# Altium schematic sheet betaV2.3.SchDoc
size A3; Organization: Altium Limited; Address1: L3, 12a Rodborough Rd; Address2: Frenchs Forest; Address3: NSW; Address4: Australia 2086
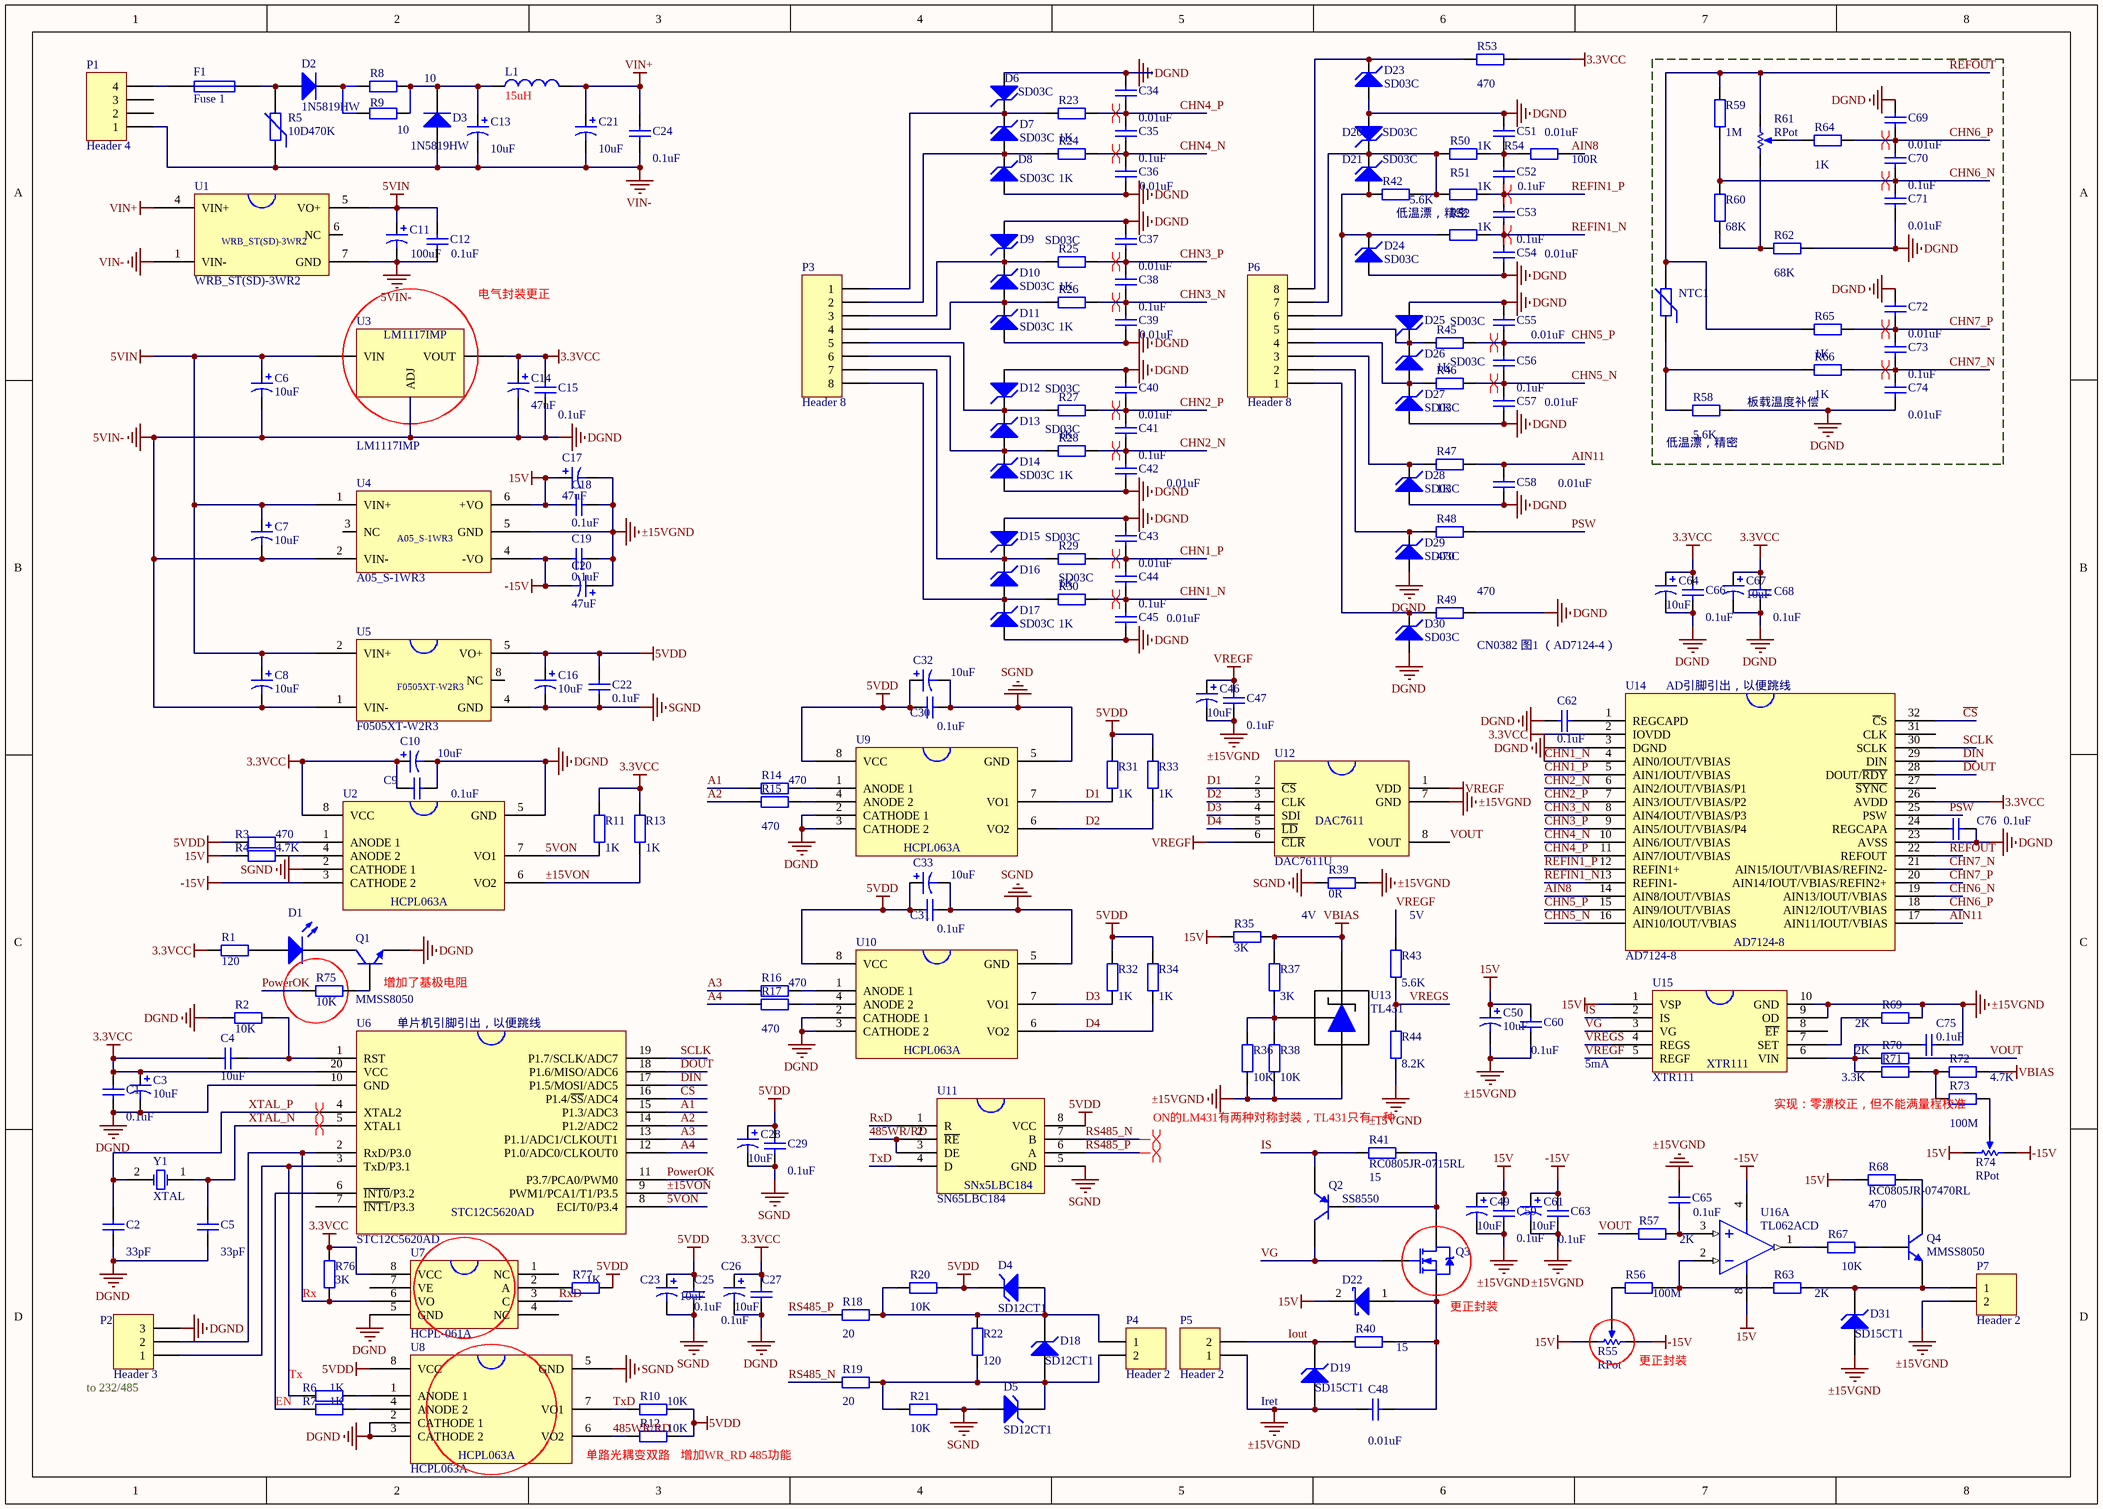
[diagram p0: betaV2.3.SchDoc]

## Parts
C1  value 0.1uF  [0805c]  (hidden comment: CC0805MRX7R9BB104)
C2  value 33pF  [0805c]  (hidden comment: CC0805MRX7R9BB330)
C3  value 10uF  [CB]  (hidden comment: T494B106M006AHAUTO)
C4  value 10uF  [0805c]  (hidden comment: CC0805MRX7R9BB106)
C5  value 33pF  [0805c]  (hidden comment: CC0805MRX7R9BB330)
C6  value 10uF  [CB]  (hidden comment: T494B106M006AHAUTO)
C7  value 10uF  [CB]  (hidden comment: T494B106M006AHAUTO)
C8  value 10uF  [CB]  (hidden comment: T494B106M006AHAUTO)
C9  value 0.1uF  [0805c]  (hidden comment: CC0805MRX7R9BB104)
C10  value 10uF  [CB]  (hidden comment: T494B106M006AHAUTO)
C11  value 100uF  [CB]  (hidden comment: T494B107M006AHAUTO)
C12  value 0.1uF  [0805c]  (hidden comment: CC0805MRX7R9BB104)
C13  value 10uF  [Φ6.3×11.5]  (hidden comment: ECR1HQG100M-063007)
C14  value 47uF  [CB]  (hidden comment: T494B476M010AHAUTO)
C15  value 0.1uF  [0805c]  (hidden comment: CC0805MRX7R9BB104)
C16  value 10uF  [CB]  (hidden comment: T494B106M006AHAUTO)
C17  value 47uF  [CB]  (hidden comment: T494B476K025ATAUTO)
C18  value 0.1uF  [0805c]  (hidden comment: CC0805MRX7R9BB104)
C19  value 0.1uF  [0805c]  (hidden comment: CC0805MRX7R9BB104)
C20  value 47uF  [CB]  (hidden comment: T494B476K025ATAUTO)
C21  value 10uF  [Φ6.3×11.5]  (hidden comment: ECR1HQG100M-063007)
C22  value 0.1uF  [0805c]  (hidden comment: CC0805MRX7R9BB104)
C23  value 10uF  [CB]  (hidden comment: T494B106M006AHAUTO)
C24  value 0.1uF  [0805c]  (hidden comment: CC0805MRX7R9BB104)
C25  value 0.1uF  [0805c]  (hidden comment: CC0805MRX7R9BB104)
C26  value 10uF  [CB]  (hidden comment: T494B106M006AHAUTO)
C27  value 0.1uF  [0805c]  (hidden comment: CC0805MRX7R9BB104)
C28  value 10uF  [CB]  (hidden comment: T494B106M006AHAUTO)
C29  value 0.1uF  [0805c]  (hidden comment: CC0805MRX7R9BB104)
C30  value 0.1uF  [0805c]  (hidden comment: CC0805MRX7R9BB104)
C31  value 0.1uF  [0805c]  (hidden comment: CC0805MRX7R9BB104)
C32  value 10uF  [CB]  (hidden comment: T494B106M006AHAUTO)
C33  value 10uF  [CB]  (hidden comment: T494B106M006AHAUTO)
C34  value 0.01uF  [0805c]  (hidden comment: CC0805MRX7R9BB103)
C35  value 0.1uF  [0805c]  (hidden comment: CC0805MRX7R9BB104)
C36  value 0.01uF  [0805c]  (hidden comment: CC0805MRX7R9BB103)
C37  value 0.01uF  [0805c]  (hidden comment: CC0805MRX7R9BB103)
C38  value 0.1uF  [0805c]  (hidden comment: CC0805MRX7R9BB104)
C39  value 0.01uF  [0805c]  (hidden comment: CC0805MRX7R9BB103)
C40  value 0.01uF  [0805c]  (hidden comment: CC0805MRX7R9BB103)
C41  value 0.1uF  [0805c]  (hidden comment: CC0805MRX7R9BB104)
C42  value 0.01uF  [0805c]  (hidden comment: CC0805MRX7R9BB103)
C43  value 0.01uF  [0805c]  (hidden comment: CC0805MRX7R9BB103)
C44  value 0.1uF  [0805c]  (hidden comment: CC0805MRX7R9BB104)
C45  value 0.01uF  [0805c]  (hidden comment: CC0805MRX7R9BB103)
C46  value 10uF  [CB]  (hidden comment: T494B106M006AHAUTO)
C47  value 0.1uF  [0805c]  (hidden comment: CC0805MRX7R9BB104)
C48  value 0.01uF  [0805c]  (hidden comment: CC0805MRX7R9BB103)
C49  value 10uF  [CB]  (hidden comment: T494B106M025AHAUTO)
C50  value 10uF  [CB]  (hidden comment: T494B106M025AHAUTO)
C51  value 0.01uF  [0805c]  (hidden comment: CC0805MRX7R9BB103)
C52  value 0.1uF  [0805c]  (hidden comment: CC0805MRX7R9BB104)
C53  value 0.1uF  [0805c]  (hidden comment: CC0805MRX7R9BB104)
C54  value 0.01uF  [0805c]  (hidden comment: CC0805MRX7R9BB103)
C55  value 0.01uF  [0805c]  (hidden comment: CC0805MRX7R9BB103)
C56  value 0.1uF  [0805c]  (hidden comment: CC0805MRX7R9BB104)
C57  value 0.01uF  [0805c]  (hidden comment: CC0805MRX7R9BB103)
C58  value 0.01uF  [0805c]  (hidden comment: CC0805MRX7R9BB103)
C59  value 0.1uF  [0805c]  (hidden comment: CC0805MRX7R9BB104)
C60  value 0.1uF  [0805c]  (hidden comment: CC0805MRX7R9BB104)
C61  value 10uF  [CB]  (hidden comment: T494B106M025AHAUTO)
C62  value 0.1uF  [0805c]  (hidden comment: CC0805MRX7R9BB104)
C63  value 0.1uF  [0805c]  (hidden comment: CC0805MRX7R9BB104)
C64  value 10uF  [CB]  (hidden comment: T494B106M006AHAUTO)
C65  value 0.1uF  [0805c]  (hidden comment: CC0805MRX7R9BB104)
C66  value 0.1uF  [0805c]  (hidden comment: CC0805MRX7R9BB104)
C67  value 10uF  [CB]  (hidden comment: T494B106M006AHAUTO)
C68  value 0.1uF  [0805c]  (hidden comment: CC0805MRX7R9BB104)
C69  value 0.01uF  [0805c]  (hidden comment: CC0805MRX7R9BB103)
C70  value 0.1uF  [0805c]  (hidden comment: CC0805MRX7R9BB104)
C71  value 0.01uF  [0805c]  (hidden comment: CC0805MRX7R9BB103)
C72  value 0.01uF  [0805c]  (hidden comment: CC0805MRX7R9BB103)
C73  value 0.1uF  [0805c]  (hidden comment: CC0805MRX7R9BB104)
C74  value 0.01uF  [0805c]  (hidden comment: CC0805MRX7R9BB103)
C75  value 0.1uF  [0805c]  (hidden comment: CC0805MRX7R9BB104)
C76  value 0.1uF  [0805c]  (hidden comment: CC0805MRX7R9BB104)
D1  150080GS75000  [LEDΦ3.0]  (value not drawn)
D2  1N5819HW  [sod123]
D3  1N5819HW  [sod123]
D4  SD12CT1  [sod323]
D5  SD12CT1  [sod323]
D6  SD03C  [sod323]
D7  SD03C  [sod323]
D8  SD03C  [sod323]
D9  SD03C  [sod323]
D10  SD03C  [sod323]
D11  SD03C  [sod323]
D12  SD03C  [sod323]
D13  SD03C  [sod323]
D14  SD03C  [sod323]
D15  SD03C  [sod323]
D16  SD03C  [sod323]
D17  SD03C  [sod323]
D18  SD12CT1  [sod323]
D19  SD15CT1  [sod323]
D20  SD03C  [sod323]
D21  SD03C  [sod323]
D22  RB160MM-50TF  [sod123]  (value not drawn)
D23  SD03C  [sod323]
D24  SD03C  [sod323]
D25  SD03C  [sod323]
D26  SD03C  [sod323]
D27  SD03C  [sod323]
D28  SD03C  [sod323]
D29  SD03C  [sod323]
D30  SD03C  [sod323]
D31  SD15CT1  [sod323]
F1  Fuse 1  [0805r]
L1  value 15uH  [vls4012]  (hidden comment: VLS4012HBX-150M)
NTC1  NTCS0805E3103JHT  [0805r]  (value not drawn)
P1  Header 4  [HDR1X4]
P2  Header 3  [HDR1X3]
P3  Header 8  [HDR1X8]
P4  Header 2  [HDR1X2]
P5  Header 2  [HDR1X2]
P6  Header 8  [HDR1X8]
P7  Header 2  [HDR1X2]
Q1  MMSS8050  [SOT-23-BJT]
Q2  SS8550  [SOT-23-BJT]
Q3  SI2309  [SOT-23-MOS]  (value not drawn)
Q4  MMSS8050  [SOT-23-BJT]
R1  value 120  [0805R]  (hidden comment: RC0805JR-07120RL)
R2  value 10K  [0805R]  (hidden comment: RC0805JR-0710KL)
R3  value 470  [0805R]  (hidden comment: RC0805JR-07470RL)
R4  value 4.7K  [0805R]  (hidden comment: RC0805JR-074700RL)
R5  10D470K  [mov]
R6  value 1K  [0805R]  (hidden comment: RC0805JR-071KL)
R7  value 1K  [0805R]  (hidden comment: RC0805JR-071KL)
R8  value 10  [0805R]  (hidden comment: PNP-200KJBJ26-10R)
R9  value 10  [0805R]  (hidden comment: PNP-200KJBJ26-10R)
R10  value 10K  [0805R]  (hidden comment: RC0805JR-0710KRL)
R11  value 1K  [0805R]  (hidden comment: RC0805JR-071KL)
R12  value 10K  [0805R]  (hidden comment: RC0805JR-0710KRL)
R13  value 1K  [0805R]  (hidden comment: RC0805JR-071KL)
R14  value 470  [0805R]  (hidden comment: RC0805JR-07470RL)
R15  value 470  [0805R]  (hidden comment: RC0805JR-07470RL)
R16  value 470  [0805R]  (hidden comment: RC0805JR-07470RL)
R17  value 470  [0805R]  (hidden comment: RC0805JR-07470RL)
R18  value 20  [0805R]  (hidden comment: RC0805JR-0720RL)
R19  value 20  [0805R]  (hidden comment: RC0805JR-0720RL)
R20  value 10K  [0805R]  (hidden comment: RC0805JR-0710KL)
R21  value 10K  [0805R]  (hidden comment: RC0805JR-0710KL)
R22  value 120  [0805R]  (hidden comment: RC0805JR-07120RL)
R23  value 1K  [0805R]  (hidden comment: RC0805JR-071KL)
R24  value 1K  [0805R]  (hidden comment: RC0805JR-071KL)
R25  value 1K  [0805R]  (hidden comment: RC0805JR-071KL)
R26  value 1K  [0805R]  (hidden comment: RC0805JR-071KL)
R27  value 1K  [0805R]  (hidden comment: RC0805JR-071KL)
R28  value 1K  [0805R]  (hidden comment: RC0805JR-071KL)
R29  value 1K  [0805R]  (hidden comment: RC0805JR-071KL)
R30  value 1K  [0805R]  (hidden comment: RC0805JR-071KL)
R31  value 1K  [0805R]  (hidden comment: RC0805JR-071KL)
R32  value 1K  [0805R]  (hidden comment: RC0805JR-071KL)
R33  value 1K  [0805R]  (hidden comment: RC0805JR-071KL)
R34  value 1K  [0805R]  (hidden comment: RC0805JR-071KL)
R35  value 3K  [0805R]  (hidden comment: RC0805JR-073KL)
R36  value 10K  [0805R]  (hidden comment: RC0805JR-0710KL)
R37  value 3K  [0805R]  (hidden comment: RC0805JR-073KL)
R38  value 10K  [0805R]  (hidden comment: RC0805JR-0710KL)
R39  value 0R  [0805R]  (hidden comment: RC0805JR-000KL)
R40  value 15  [0805R]  (hidden comment: RC0805JR-0715RL)
R41  RC0805JR-0715RL  value 15  [0805R]
R42  value 5.6K  [0805R]  (hidden comment: RC0805JR-075600RL)
R43  value 5.6K  [0805R]  (hidden comment: RC0805JR-075600RL)
R44  value 8.2K  [0805R]  (hidden comment: RC0805JR-078200RL)
R45  value 1K  [0805R]  (hidden comment: RC0805JR-071KL)
R46  value 1K  [0805R]  (hidden comment: RC0805JR-071KL)
R47  value 1K  [0805R]  (hidden comment: RC0805JR-071KL)
R48  value 470  [0805R]  (hidden comment: RC0805JR-07470RL)
R49  value 470  [0805R]  (hidden comment: RC0805JR-07470RL)
R50  value 1K  [0805R]  (hidden comment: RC0805JR-071KL)
R51  value 1K  [0805R]  (hidden comment: RC0805JR-071KL)
R52  value 1K  [0805R]  (hidden comment: RC0805JR-071KL)
R53  value 470  [0805R]  (hidden comment: RC0805JR-07470RL)
R54  value 100R  [0805R]  (hidden comment: RC0805JR-07100RL)
R55  RPot  [VR5]
R56  value 100M  [0805R]  (hidden comment: RC0805JR-07100ML)
R57  value 2K  [0805R]  (hidden comment: RC0805JR-072KL)
R58  value 5.6K  [0805R]  (hidden comment: RC0805JR-075600RL)
R59  value 1M  [0805R]  (hidden comment: RC0805JR-071000KL)
R60  value 68K  [0805R]  (hidden comment: RC0805JR-0768KL)
R61  RPot  [VR5]
R62  value 68K  [0805R]  (hidden comment: RC0805JR-0768KL)
R63  value 2K  [0805R]  (hidden comment: RC0805JR-072KL)
R64  value 1K  [0805R]  (hidden comment: RC0805JR-071KL)
R65  value 1K  [0805R]  (hidden comment: RC0805JR-071KL)
R66  value 1K  [0805R]  (hidden comment: RC0805JR-071KL)
R67  value 10K  [0805R]  (hidden comment: RC0805JR-0710KL)
R68  RC0805JR-07470RL  value 470  [0805R]
R69  value 2K  [0805R]  (hidden comment: RC0805JR-072KL)
R70  value 2K  [0805R]  (hidden comment: RC0805JR-072KL)
R71  value 3.3K  [0805R]  (hidden comment: RC0805JR-073300RL)
R72  value 4.7K  [0805R]  (hidden comment: RC0805JR-074700RL)
R73  value 100M  [0805R]  (hidden comment: RC0805JR-07100ML)
R74  RPot  [VR5]
R75  value 10K  [0805R]  (hidden comment: RC0805JR-0710KL)
R76  value 3K  [0805R]  (hidden comment: RC0805JR-073KL)
R77  value 1K  [0805R]  (hidden comment: RC0805JR-071KL)
U1  WRB_ST(SD)-3WR2  [WRB_ST(SD)-3WR2]
U2  HCPL063A  [SO-8-N]  (value not drawn)
U3  LM1117IMP  [SOT223_M]
U4  A05_S-1WR3  [A05_S-1WR3]
U5  F0505XT-W2R3  [F0505XT-W2R3]
U6  STC12C5620AD  [SOP20]
U7  HCPL-061A  [SO-8-N]
U8  HCPL063A  [SO-8-N]
U9  HCPL063A  [SO-8-N]  (value not drawn)
U10  HCPL063A  [SO-8-N]  (value not drawn)
U11  SN65LBC184  [so-8-n]
U12  DAC7611U  [so-8-n]
U13  TL431  [SOT-23-3]
U14  AD7124-8  [TI-RHB32-3150X3150TP_V]
U15  XTR111  [S-PDSO-G10]
U16  TL062ACD  [so-8-n]  (part A of 2)
Y1  XTAL  [11.0592MHz]

## Nets
3.3VCC: C1.1 C3.1 C4.1 C9.1 C10.1 C14.1 C15.1 C26.1 C27.1 C64.1 C66.1 C67.1 C68.1 R1.1 R11.1 R13.1 R53.1 R76.2 U2.8(VCC) U3.2(VOUT) U6.20(VCC) U7.8(VCC) U14.2(IOVDD) U14.26(AVDD)
5VDD: C16.1 C22.2 C23.1 C25.1 C28.1 C29.1 C30.1 C31.1 C32.1 C33.1 D4.2(K) R3.2 R10.1 R12.1 R20.1 R31.1 R32.1 R33.1 R34.1 R77.1 U5.5(VO+) U8.8(VCC) U9.8(VCC) U10.8(VCC) U11.8(VCC)
5VIN: C6.1 C7.1 C8.1 C11.1 C12.2 U1.5(VO+) U3.3(VIN) U4.1(VIN+) U5.2(VIN+)
5VIN-: C1.2 C2.2 C3.2 C5.2 C6.2 C7.2 C8.2 C9.2 C10.2 C11.2 C12.1 C14.2 C15.2 C26.2 C27.2 C34.2 C36.2 C37.2 C39.2 C40.2 C42.2 C43.2 C45.2 C51.2 C54.2 C55.2 C57.2 C58.2 C62.1 C64.2 C66.2 C67.2 C68.2 C69.2 C71.2 C72.2 C74.2 C76.1 D6.1(ANODE) D8.1(ANODE) D9.1(ANODE) D11.1(ANODE) D12.1(ANODE) D14.1(ANODE) D15.1(ANODE) D17.1(ANODE) D20.1(ANODE) D23.1(ANODE) D24.1(ANODE) D25.1(ANODE) D27.1(ANODE) D28.1(ANODE) D29.1(ANODE) D30.1(ANODE) P2.3 Q1.3(E) R2.1 R49.1 R58.1 R62.1 U1.7(GND) U2.5(GND) U3.1(ADJ) U4.2(VIN-) U5.1(VIN-) U6.10(GND) U7.5(GND) U8.2(CATHODE_1) U8.3(CATHODE_2) U9.2(CATHODE_1) U9.3(CATHODE_2) U10.2(CATHODE_1) U10.3(CATHODE_2) U14.3(DGND) U14.23(AVSS)  [also labelled DGND]
15V: C17.1 C18.1 C49.1 C50.1 C59.2 C60.2 D22.2(K) R4.2 R35.1 R55.1(BOT) R68.1 R74.1(BOT) U4.6(+VO) U15.1(VSP) U16.8(VCC+)
-15V: C19.1 C20.2 C61.1 C63.2 R55.3(TOP) R74.3(TOP) U2.3(CATHODE_2) U4.4(-VO) U16.4(VCC-)
SGND: C16.2 C22.1 C23.2 C25.2 C28.2 C29.2 C30.2 C31.2 C32.2 C33.2 D5.1(A) R21.1 R39.1 U2.2(CATHODE_1) U5.4(GND) U8.5(GND) U9.5(GND) U10.5(GND) U11.5(GND)
VBIAS: R35.2 R37.1 R72.1 U13.1(CATHODE)
VIN+: C21.1 C24.1 L1.2 U1.4(VIN+)
VIN-: C13.2 C21.2 C24.2 D3.1(A) P1.1 R5.1 U1.1(VIN-)
VREGF: C46.1 C47.2 R43.1 U12.1(VDD) U12.6(~{CLR}) U15.5(REGF)
±15VGND: C17.2 C18.2 C19.2 C20.1 C46.2 C47.1 C48.2 C49.2 C50.2 C59.1 C60.1 C61.2 C63.1 C65.2 C75.1 D19.1(A) D31.1(A) P5.1 P7.2 R36.2 R38.2 R39.2 R44.2 R69.1 U4.5(GND) U12.7(GND) U13.3(ANODE) U15.9(OD) U15.10(GND)
5VON: R11.2 U2.7(VO1) U6.8(ECI/T0/P3.4)
485WR/RD: R12.2 U8.6(VO2) U11.2(~{RE}) U11.3(DE)
A1: R14.2 U6.15(P1.3/ADC3)
A2: R15.2 U6.14(P1.2/ADC2)
A3: R16.2 U6.13(P1.1/ADC1/CLKOUT1)
A4: R17.2 U6.12(P1.0/ADC0/CLKOUT0)
AIN8: R54.1 U14.14(AIN8/IOUT/VBIAS)
AIN11: C58.1 R47.1 U14.17(AIN11/IOUT/VBIAS)
~{CS}: U6.16(P1.4/~{SS}/ADC4) U14.32(~{C}S)
CHN1_N: C44.2 C45.1 R30.1 U14.4(AIN0/IOUT/VBIAS)
CHN1_P: C43.1 C44.1 R29.1 U14.5(AIN1/IOUT/VBIAS)
CHN2_N: C41.2 C42.1 R28.1 U14.6(AIN2/IOUT/VBIAS/P1)
CHN2_P: C40.1 C41.1 R27.1 U14.7(AIN3/IOUT/VBIAS/P2)
CHN3_N: C38.2 C39.1 R26.1 U14.8(AIN4/IOUT/VBIAS/P3)
CHN3_P: C37.1 C38.1 R25.1 U14.9(AIN5/IOUT/VBIAS/P4)
CHN4_N: C35.2 C36.1 R24.1 U14.10(AIN6/IOUT/VBIAS)
CHN4_P: C34.1 C35.1 R23.1 U14.11(AIN7/IOUT/VBIAS)
CHN5_N: C56.2 C57.1 R46.1 U14.16(AIN10/IOUT/VBIAS)
CHN5_P: C55.1 C56.1 R45.1 U14.15(AIN9/IOUT/VBIAS)
CHN6_N: C70.2 C71.1 R59.2 R60.1 U14.19(AIN13/IOUT/VBIAS)
CHN6_P: C69.1 C70.1 R64.1 U14.18(AIN12/IOUT/VBIAS)
CHN7_N: C73.2 C74.1 R66.1 U14.21(AIN15/IOUT/VBIAS/REFIN2-)
CHN7_P: C72.1 C73.1 R65.1 U14.20(AIN14/IOUT/VBIAS/REFIN2+)
D1: R31.2 U9.7(VO1) U12.2(~{CS})
D2: R33.2 U9.6(VO2) U12.3(CLK)
D3: R32.2 U10.7(VO1) U12.4(SDI)
D4: R34.2 U10.6(VO2) U12.5(~{LD})
DIN: U6.17(P1.5/MOSI/ADC5) U14.29(DIN)
DOUT: U6.18(P1.6/MISO/ADC6) U14.28(DOUT/~{RDY})
Iout: D19.2(K) P5.2 R40.1
IS: Q2.3(E) R41.2 U15.2(IS)
PowerOK: R75.1 U6.11(P3.7/PCA0/PWM0)
PSW: R48.1 U14.25(PSW)
REFIN1_N: C53.2 C54.1 R52.1 U14.13(REFIN1-)
REFIN1_P: C52.1 C53.1 R51.1 U14.12(REFIN1+)
REFOUT: NTC1.2 R59.1 R61.1(BOT) R65.2 U14.22(REFOUT)
RS485_N: R19.2 U11.7(B)
RS485_P: R18.1 U11.6(A)
RxD: U7.3(C) U11.1(R)
SCLK: U6.19(P1.7/SCLK/ADC7) U14.30(SCLK)
TxD: R10.2 U8.7(VO1) U11.4(D)
VG: Q2.1(C) Q3.1(G) U15.3(VG)
VOUT: R57.2 R70.1 U12.8(VOUT)
VREGS: R43.2 R44.1 U15.4(REGS)
XTAL_N: C5.1 U6.5(XTAL1) Y1.1(OSC1)
XTAL_P: C2.1 U6.4(XTAL2) Y1.2(OSC2)
±15VON: R13.2 U2.6(VO2) U6.9(PWM1/PCA1/T1/P3.5)
NetC4_2: C4.2 R2.2 U6.1(RST)
NetC13_1: C13.1 D3.2(K) L1.1 R8.1 R9.1
NetC48_1: C48.1 D22.1(A) Q3.3(S) R40.2
NetC51_1: C51.1 C52.2 R50.1 R54.2
NetC62_2: C62.2 U14.1(REGCAPD)
NetC65_1: C65.1 R57.1 U16.3(IN1+)
NetC75_2: C75.2 R70.2 R71.2 U15.6(VIN)
NetC76_2: C76.2 U14.24(REGCAPA)
NetD1_1: D1.1(A) R1.2
NetD1_2: D1.2(K) Q1.1(C)
NetD2_1: D2.1(A) F1.2 R5.2
NetD2_2: D2.2(K) R8.2 R9.2
NetD4_1: D4.1(A) D18.2(K) P4.1 R18.2 R20.2 R22.2
NetD5_2: D5.2(K) D18.1(A) P4.2 R19.1 R21.2 R22.1
NetD6_2: D6.2(CATHODE) D7.2(CATHODE) P3.1 R23.2
NetD7_1: D7.1(ANODE) D8.2(CATHODE) P3.2 R24.2
NetD9_2: D9.2(CATHODE) D10.2(CATHODE) P3.3 R25.2
NetD10_1: D10.1(ANODE) D11.2(CATHODE) P3.4 R26.2
NetD12_2: D12.2(CATHODE) D13.2(CATHODE) P3.5 R27.2
NetD13_1: D13.1(ANODE) D14.2(CATHODE) P3.6 R28.2
NetD15_2: D15.2(CATHODE) D16.2(CATHODE) P3.7 R29.2
NetD16_1: D16.1(ANODE) D17.2(CATHODE) P3.8 R30.2
NetD20_2: D20.2(CATHODE) D21.2(CATHODE) P6.7 R42.2 R50.2 R51.2
NetD21_1: D21.1(ANODE) D24.2(CATHODE) P6.6 R42.1 R52.2
NetD23_2: D23.2(CATHODE) P6.8 R53.2
NetD25_2: D25.2(CATHODE) D26.2(CATHODE) P6.5 R45.2
NetD26_1: D26.1(ANODE) D27.2(CATHODE) P6.4 R46.2
NetD28_2: D28.2(CATHODE) P6.3 R47.2
NetD29_2: D29.2(CATHODE) P6.2 R48.2
NetD30_2: D30.2(CATHODE) P6.1 R49.2
NetD31_2: D31.2(K) P7.1 Q4.3(E) R63.1
NetF1_1: F1.1 P1.4
NetNTC1_1: NTC1.1 R58.2 R66.2
NetP2_1: P2.1 R6.2 U6.3(TxD/P3.1)
NetP2_2: P2.2 R76.1 U6.2(RxD/P3.0) U7.6(VO)
NetQ1_2: Q1.2(B) R75.2
NetQ2_2: Q2.2(B) Q3.2(D) R41.1
NetQ4_1: Q4.1(C) R68.2
NetQ4_2: Q4.2(B) R67.1
NetR3_1: R3.1 U2.1(ANODE_1)
NetR4_1: R4.1 U2.4(ANODE_2)
NetR6_1: R6.1 U8.1(ANODE_1)
NetR7_1: R7.1 U8.4(ANODE_2)
NetR7_2: R7.2 U6.6(~{INT0}/P3.2)
NetR14_1: R14.1 U9.1(ANODE_1)
NetR15_1: R15.1 U9.4(ANODE_2)
NetR16_1: R16.1 U10.1(ANODE_1)
NetR17_1: R17.1 U10.4(ANODE_2)
NetR36_1: R36.1 R37.2 R38.1 U13.2(REF)
NetR55_2: R55.2(TAP) R56.2
NetR56_1: R56.1 R63.2 U16.2(IN1-)
NetR60_2: R60.2 R61.3(TOP) R62.2
NetR61_2: R61.2(TAP) R64.2
NetR67_2: R67.2 U16.1(OUT1)
NetR69_2: R69.2 U15.7(SET)
NetR71_1: R71.1 R72.2 R73.1
NetR73_2: R73.2 R74.2(TAP)
NetR77_2: R77.2 U7.2(A)

Not connected (* = marked no-connect by the designer): P1 2 3; U1 6(NC); U4 3(NC); U5 8(NC); U6 7(~{INT1}/P3.3); U7 1(NC) 4(NC) 7(VE); U14 27(~{SYNC}) 31(CLK); U15 8(~{EF})

## Layout directives
differential pair; differential pair class *: CHN1_P
differential pair: CHN1_N, CHN2_N, CHN2_P, CHN3_N, CHN3_P, CHN4_N, CHN4_P, CHN5_N, CHN5_P, CHN6_N, CHN6_P, CHN7_N, CHN7_P, REFIN1_N, REFIN1_P, RS485_N, RS485_P, XTAL_N, XTAL_P

## Notes on the sheet
- 低温漂，精密
- 电气封装更正
- (near R58) 低温漂，精密
- 板载温度补偿
- (near R49) CN0382 图1 （AD7124-4）
- (near U14) AD引脚引出，以便跳线
- 4V
- (near R43) 5V
- (near Q1) 增加了基极电阻
- (near U6) 单片机引脚引出，以便跳线
- ON的LM431有两种对称封装，TL431只有一种
- 5mA
- 实现：零漂校正，但不能满量程校准
- (near R76) Rx
- (near Q3) 更正封装
- (near P2) to 232/485
- Tx
- (near R55) 更正封装
- EN
- 单路光耦变双路
- (near R12) 增加WR_RD 485功能
- (near D19) Iret
- Title
- Size:
- Date:
- A3
- Number:
- Time:
- Revision:
- Sheet
- of
- File:

## Library data of the parts
C1 C2 C4 C5 C9 C12 C15 C18 C19 C22 C24 C25 C27 C29-C31 C34-C45 C47 C48 C51-C60 C62 C63 C65 C66 C68-C76 = Cap: Capacitor
  C2 C5 C9 C12 C15 C18 C19 C22 C24 C25 C27 C29-C31 C34-C45 C47 C48 C51-C60 C62 C63 C65 C66 C68-C76: Published: 8-Jun-2000; LatestRevisionDate: 17-Jul-2002; LatestRevisionNote: Re-released for DXP Platform.; PackageReference: RAD-0.3; Publisher: Altium Limited; PackageDescription: Radial Cap, Thru-Hole; 2 Leads; 0.3 in Pin Spacing
C3 C6-C8 C10 C11 C13 C14 C16 C17 C20 C21 C23 C26 C28 C32 C33 C46 C49 C50 C61 C64 C67 = Cap Pol1: Polarized Capacitor (Radial); Published: 8-Jun-2000; LatestRevisionDate: 17-Jul-2002; LatestRevisionNote: Re-released for DXP Platform.; PackageReference: RB7.6-15; Publisher: Altium Limited; PackageDescription: Polarized Capacitor (Radial); 2 Leads
D1 = LED2: Typical RED, GREEN, YELLOW, AMBER GaAs LED; Published: 8-Jun-2000; LatestRevisionDate: 17-Jul-2002; LatestRevisionNote: Re-released for DXP Platform.; PackageVersion: Feb-2002; PackageReference: 3.2X1.6X1.1; Publisher: Altium Limited; PackageDescription: SM LED; 2 Flat Leads
D2 D3 = Diode: Default Diode; Published: 8-Jun-2000; LatestRevisionDate: 17-Jul-2002; LatestRevisionNote: Re-released for DXP Platform.; PackageVersion: Sep-1996; PackageReference: SMC; Publisher: Altium Limited; PackageDescription: DO-214-AB/SMC; 2 C-Bend Leads; Body 7.9 x 5.9 mm, inc. leads (LxW); Code_JEDEC: DO-214-AB
D4 D5 D18 D19 D31 = D Zener: Zener Diode; Published: 8-Jun-2000; LatestRevisionDate: 17-Jul-2002; LatestRevisionNote: Re-released for DXP Platform.; PackageReference: DIODE-0.7; Publisher: Altium Limited; PackageDescription: Diode, Thru-Hole; 2 Leads; 0.7 in Pin Spacing
D6-D17 D20 D21 D23-D30 = TVS DIODE
D22 = D Schottky: Schottky Diode; Published: 8-Jun-2000; LatestRevisionDate: 17-Jul-2002; LatestRevisionNote: Re-released for DXP Platform.; PackageReference: SMB; Publisher: Altium Limited; PackageDescription: DO-214-AA/SMB; 2 C-Bend Leads; Body 5.3 x 3.6 mm, inc. leads (LxW); Code_JEDEC: DO-214-AA
F1 = Fuse 1: Fuse; Published: 8-Jun-2000; LatestRevisionDate: 17-Jul-2002; LatestRevisionNote: Re-released for DXP Platform.; PackageReference: PIN-W2/E2.8; Publisher: Altium Limited; PackageDescription: Thru-Hole; 2 Leads
L1 = Inductor
NTC1 R5 = Res Varistor: Varistor (Voltage-Sensitive Resistor); Published: 24-Mar-1999; LatestRevisionDate: 29-May-2009; LatestRevisionNote: IPC-7351 Footprint Added.; PackageVersion: Mar-2003; PackageReference: 6-0805; Publisher: Altium Limited; PackageDescription: Chip Resistor 0805 Case Size; Code_IPC: RESC2012
P1 = Header 4: Header, 4-Pin; LatestRevisionDate: 17-Jul-2002; LatestRevisionNote: Re-released for DXP Platform.; Publisher: Altium Limited
P2 = Header 3: Header, 3-Pin; LatestRevisionDate: 17-Jul-2002; LatestRevisionNote: Re-released for DXP Platform.; Publisher: Altium Limited
P3 P6 = Header 8: Header, 8-Pin; LatestRevisionDate: 17-Jul-2002; LatestRevisionNote: Re-released for DXP Platform.; Publisher: Altium Limited
P4 P5 P7 = Header 2: Header, 2-Pin; LatestRevisionDate: 17-Jul-2002; LatestRevisionNote: Re-released for DXP Platform.; Publisher: Altium Limited
Q1 Q4 = NPN: NPN Bipolar Transistor; Published: 8-Jun-2000; LatestRevisionDate: 17-Jul-2002; LatestRevisionNote: Re-released for DXP Platform.; PackageReference: TO-226-AA; Publisher: Altium Limited; PackageDescription: TO, Flat Index; 3 In-Line, Axial Leads; Body Dia. 4.8mm; Leads 0.55 x 0.51 mm (max); Code_JEDEC: TO-226-AA
Q2 = PNP: PNP Bipolar Transistor; Published: 8-Jun-2000; LatestRevisionDate: 29-May-2009; LatestRevisionNote: IPC-7351 Footprint Added.; PackageVersion: Aug-1999; PackageReference: SOT-23B; Publisher: Altium Limited; PackageDescription: 3-Pin SOT-23 Package 0.95 mm Pitch, 2.4 mm Lead Span
Q3 = NMOS-2: N-Channel Power MOSFET; Note: Pin 2 is electrically connected to pin 4.; Published: 8-Jun-2000; LatestRevisionDate: 17-Jul-2002; LatestRevisionNote: Re-released for DXP Platform.; DatasheetVersion: PD-9.814; PackageVersion: Feb-1997; PackageReference: TO-220AB; Publisher: Altium Limited; PackageDescription: TO, Thru-Hole, Vertical, Heatsink Mounted; 3 In-Line Leads; Pitch 2.54 mm; ComponentLink1Description: Manufacturer Link; ComponentLink1URL: http://www.irf.com/
R1-R4 R6-R54 R56-R60 R62-R73 R75-R77 = Res2: Resistor; Published: 8-Jun-2000; LatestRevisionDate: 17-Jul-2002; LatestRevisionNote: Re-released for DXP Platform.; PackageReference: AXIAL-0.4; Publisher: Altium Limited; PackageDescription: Axial Device, Thru-Hole; 2 Leads; 0.4 in Pin Spacing
R55 R61 R74 = RPot: Potentiometer; Sim Note: Enter the Resistance value and the set point into parameter fields.; Set Position: 0.5; Value: 1K; Published: 8-Jun-2000; LatestRevisionDate: 17-Jul-2002; LatestRevisionNote: Re-released for DXP Platform.; PackageReference: VR5; Publisher: Altium Limited; PackageDescription: Variable Resistor, Thru-Hole; 3 Leads
U7 = 6N137
U11 = SNx5LBC184
U12 = DAC7611
U16 = TL062ACD: Low-Power JFET-Input Operational Amplifier, 7 to 36 V, 0 to 70 degC, 8-pin SOIC (D8), Green (RoHS & no Sb/Br); Manufacturer: Texas Instruments; CMRR(Min)(dB): 80; GBW(Typ)(MHz): 1; IIB(Max)(pA): 200; Iq per channel(Max)(mA): 0.25; Number of Channels: 2; Offset Drift(Typ)(uV/C): 10; Rating: Catalog; Slew Rate(Typ)(V/us): 3.5; Sub Family: General Purpose Amplifier, High Supply Voltage Amplifier (>=30V), Low Power Amp (<=500uA); Total Supply Voltage(Max)(+5V is 5, +/-5V is 10): 36; Total Supply Voltage(Min)(+5V is 5, +/-5V is 10): 7; Vio (25C)(Max)(mV): 6; Vn at 1kHz(Typ)(nV/rtHz): 42; DatasheetVersion: SLOS078J; PackageVersion: 4040047-3/M, 06/2011; PackageReference: D8; PackageDescription: 8-Pin Plastic Small Outline, Body 4.9 x 3.9 mm, Pitch 1.27 mm; Supplier 1: Digi-Key; Supplier Part Number 1: 296-7175-5-ND; Supplier 2: Farnell; Supplier Part Number 2: 9593241; Supplier 3: Newark; Supplier Part Number 3: 08F9224; Supplier 4: Mouser; Supplier Part Number 4: 595-TL062ACD; Eco-Plan: Green (RoHS & no Sb/Br); Mounting Technology: Surface Mount; Code_JEDEC: MS-012; PartNumber: TL062ACD; ComponentLink1Description: Manufacturer URL; ComponentLink1URL: http://www.ti.com/; ComponentLink2Description: Datasheet; ComponentLink2URL: http://www.ti.com/lit/ds/symlink/tl062a.pdf; ComponentLink3Description: Package Specification; ComponentLink3URL: http://www.ti.com/litv/pdf/msoi002j
Y1 = XTAL: Crystal Oscillator; Published: 8-Jun-2000; LatestRevisionDate: 17-Jul-2002; LatestRevisionNote: Re-released for DXP Platform.; PackageReference: R38; Publisher: Altium Limited; PackageDescription: Crystal, Thru-Hole; 2 Leads; Body 3.1 x 8.2 mm (Dia.xH)